# EAGLE schematic Xplained_RFM98W (EAGLE 9.3.2)
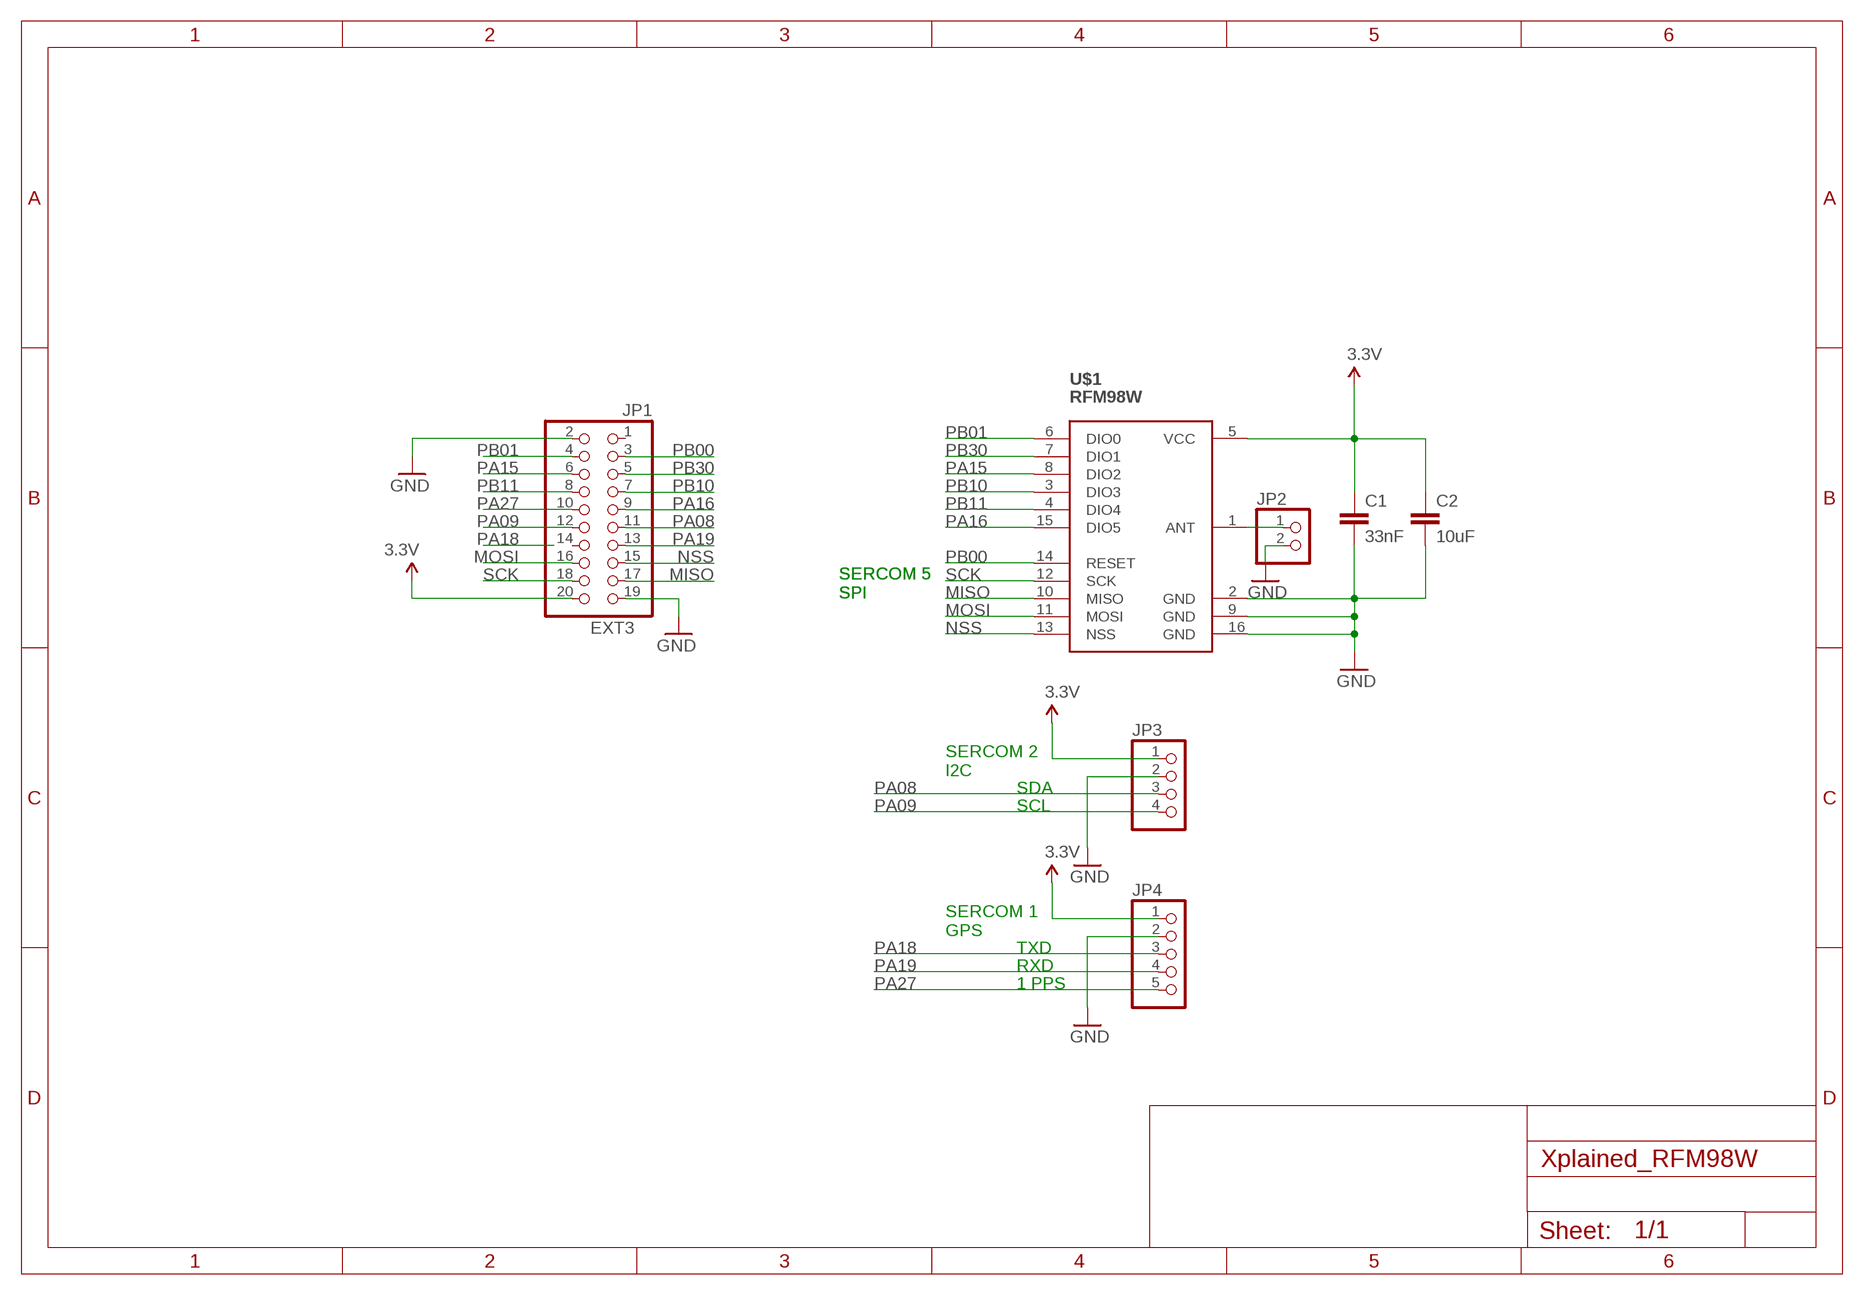
[diagram p0: schematic, sheet 1]

## Parts
C1  33nF  CAP0603-CAP  [0603-CAP]
C2  10uF  CAP0603-CAP  [0603-CAP]
JP1  EXT3  PINHD-2X10/90  [2X10/90]
JP2  PINHD-1X2  [1X02]
JP3  PINHD-1X4/90  [1X04/90]
JP4  PINHD-1X5/90  [1X05/90]
U$1  RFM98W  RFM66W_69HCW_9XW  [MODULE_16X16_16PIN]

## Nets
3.3V: C1.1 C2.1 JP1.20 JP3.1 JP4.1 U$1.5(VCC)
GND: C1.2 C2.2 JP1.2 JP1.19 JP2.2 JP3.2 JP4.2 U$1.2(GND) U$1.9(GND) U$1.16(GND)
MISO: JP1.17 U$1.10(MISO)
MOSI: JP1.16 U$1.11(MOSI)
N$6: JP2.1 U$1.1(ANT)
NSS: JP1.15 U$1.13(NSS)
PA08: JP1.11 JP3.3
PA09: JP1.12 JP3.4
PA15: JP1.6 U$1.8(DIO2)
PA16: JP1.9 U$1.15(DIO5)
PA18: JP4.3
PA19: JP1.13 JP4.4
PA27: JP1.10 JP4.5
PB00: JP1.3 U$1.14(RESET)
PB01: JP1.4 U$1.6(DIO0)
PB10: JP1.7 U$1.3(DIO3)
PB11: JP1.8 U$1.4(DIO4)
PB30: JP1.5 U$1.7(DIO1)
SCK: JP1.18 U$1.12(SCK)
Unconnected: JP1.1 JP1.14

## Notes on the sheet
- SERCOM 5
  SPI
- SERCOM 5
  SPI
- SERCOM 2
  I2C
- SDA
- SCL
- SERCOM 1
  GPS
- TXD
- RXD
- 1 PPS

## Library data of the parts
C1 C2 = SparkFun:CAP: Capacitor Standard 0603 ceramic capacitor, and 0.1" leaded capacitor.
JP1 = pinhead:PINHD-2X10: PIN HEADER
JP2 = pinhead:PINHD-1X2: PIN HEADER
JP3 = pinhead:PINHD-1X4: PIN HEADER
JP4 = pinhead:PINHD-1X5: PIN HEADER
U$1 = hoperf:RFM66W_69HCW_9XW